# Altium schematic sheet 05_LMS7002M_Misc.SchDoc: LMS7002M misc (part 1 of 2)
size A3; Organization: Lime Microsystems; Address1: Surrey Tech Centre; Address2: Guildford GU2 7YG; Address3: Surrey; Address4: United Kingdom; SheetNumber: 5
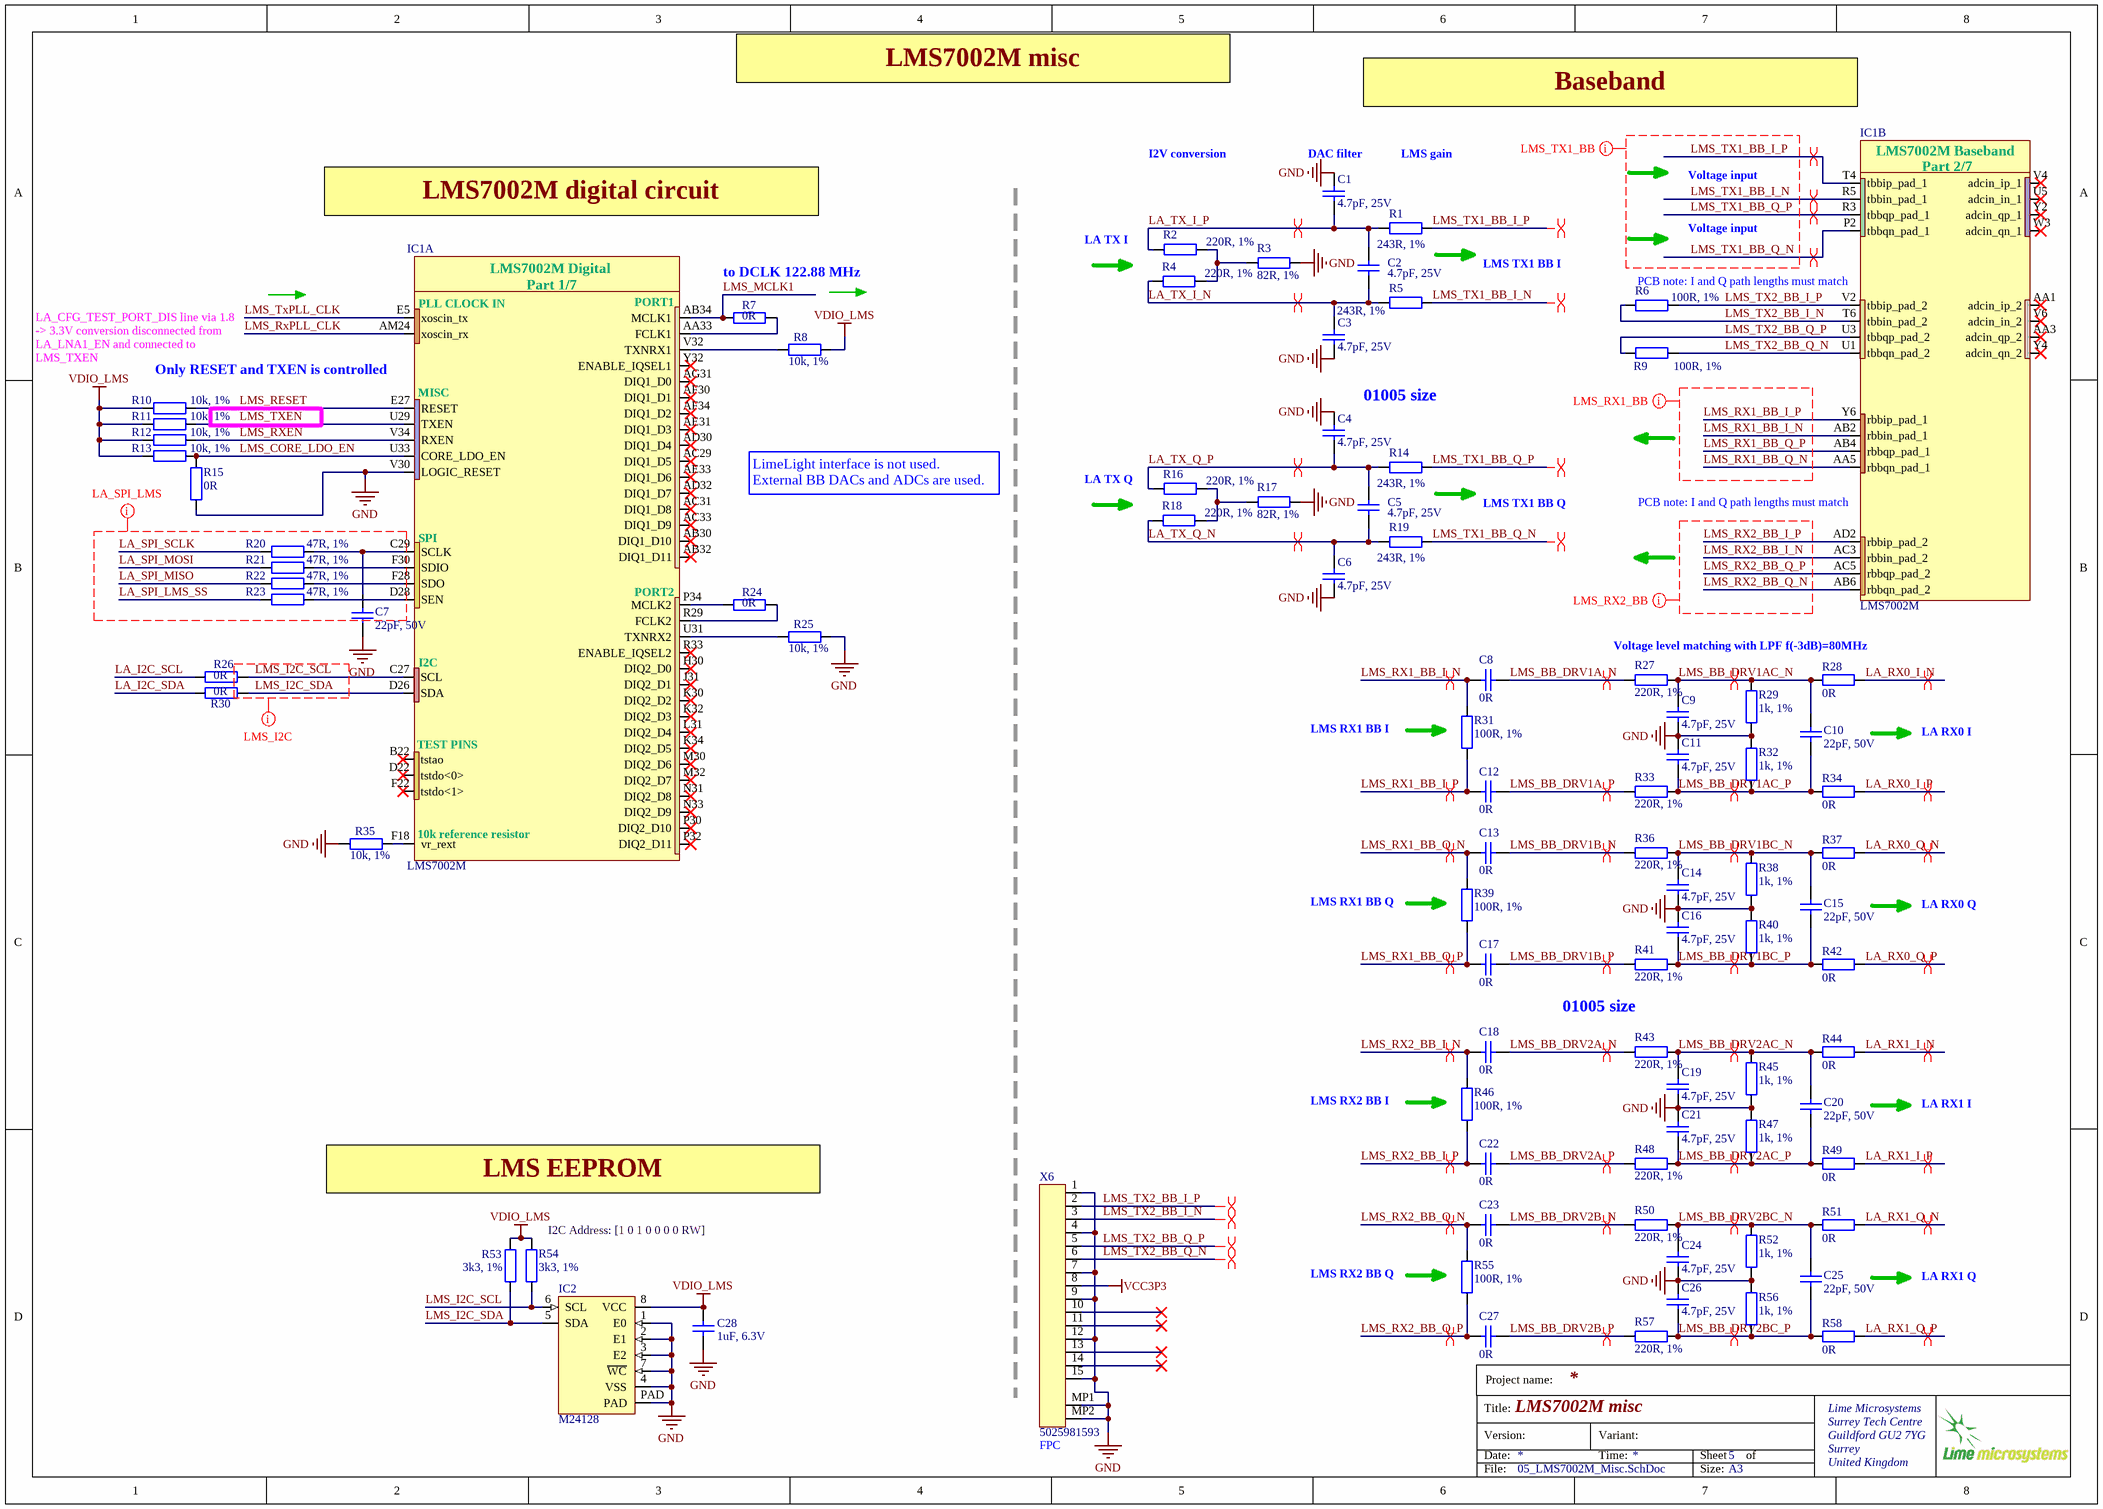
[diagram p0: 05_LMS7002M_Misc.SchDoc]

## Parts
C1  4.7pF, 25V  [CAP01005]
C2  4.7pF, 25V  [CAP01005]
C3  4.7pF, 25V  [CAP01005]
C4  4.7pF, 25V  [CAP01005]
C5  4.7pF, 25V  [CAP01005]
C6  4.7pF, 25V  [CAP01005]
C7  22pF, 50V  [CAP0201]
C8  0R  [CAP01005]
C9  4.7pF, 25V  [CAP01005]
C10  22pF, 50V  [CAP01005]
C11  4.7pF, 25V  [CAP01005]
C12  0R  [CAP01005]
C13  0R  [CAP01005]
C14  4.7pF, 25V  [CAP01005]
C15  22pF, 50V  [CAP01005]
C16  4.7pF, 25V  [CAP01005]
C17  0R  [CAP01005]
C18  0R  [CAP01005]
C19  4.7pF, 25V  [CAP01005]
C20  22pF, 50V  [CAP01005]
C21  4.7pF, 25V  [CAP01005]
C22  0R  [CAP01005]
C23  0R  [CAP01005]
C24  4.7pF, 25V  [CAP01005]
C25  22pF, 50V  [CAP01005]
C26  4.7pF, 25V  [CAP01005]
C27  0R  [CAP01005]
C28  1uF, 6.3V  [CAP0201]
IC1  LMS7002M  [LMS7002M_v5_LESS_SILK]  (parts A,B of 7)
IC2  M24128  [M24128-DFMC6TG]
R1  243R, 1%  [RES01005]
R2  220R, 1%  [RES01005]
R3  82R, 1%  [RES01005]
R4  220R, 1%  [RES01005]
R5  243R, 1%  [RES01005]
R6  100R, 1%  [RES0201]
R7  0R  [RES0201]
R8  10k, 1%  [RES0201]
R9  100R, 1%  [RES0201]
R10  10k, 1%  [RES0201]
R11  10k, 1%  [RES0201]
R12  10k, 1%  [RES0201]
R13  10k, 1%  [RES0201]
R14  243R, 1%  [RES01005]
R15  0R  [RES0402]
R16  220R, 1%  [RES01005]
R17  82R, 1%  [RES01005]
R18  220R, 1%  [RES01005]
R19  243R, 1%  [RES01005]
R20  47R, 1%  [RES0201]
R21  47R, 1%  [RES0201]
R22  47R, 1%  [RES0201]
R23  47R, 1%  [RES0201]
R24  0R  [RES0201]
R25  10k, 1%  [RES0201]
R26  0R  [RES0201]
R27  220R, 1%  [RES01005]
R28  0R  [RES01005]
R29  1k, 1%  [RES01005]
R30  0R  [RES0201]
R31  100R, 1%  [RES01005]
R32  1k, 1%  [RES01005]
R33  220R, 1%  [RES01005]
R34  0R  [RES01005]
R35  10k, 1%  [RES0201]
R36  220R, 1%  [RES01005]
R37  0R  [RES01005]
R38  1k, 1%  [RES01005]
R39  100R, 1%  [RES01005]
R40  1k, 1%  [RES01005]
R41  220R, 1%  [RES01005]
R42  0R  [RES01005]
R43  220R, 1%  [RES01005]
R44  0R  [RES01005]
R45  1k, 1%  [RES01005]
R46  100R, 1%  [RES01005]
R47  1k, 1%  [RES01005]
R48  220R, 1%  [RES01005]
R49  0R  [RES01005]
R50  220R, 1%  [RES01005]
R51  0R  [RES01005]
R52  1k, 1%  [RES01005]
R53  3k3, 1%  [RES0201]
R54  3k3, 1%  [RES0201]
R55  100R, 1%  [RES01005]
R56  1k, 1%  [RES01005]
R57  220R, 1%  [RES01005]
R58  0R  [RES01005]
X6  5025981593  [5025981593_FPC_connector]

## Nets
GND: C1.1 C3.2 C4.1 C6.2 C7.1 C9.2 C11.1 C14.2 C16.1 C19.2 C21.1 C24.2 C26.1 C28.2 IC1.V30(LOGIC_RESET) IC2.1(E0) IC2.2(E1) IC2.3(E2) IC2.4(VSS) IC2.7(~{WC}) IC2.PAD R3.1 R15.1 R17.1 R25.1 R29.2 R32.1 R35.2 R38.2 R40.1 R45.2 R47.1 R52.2 R56.1 X6.1 X6.4 X6.7 X6.9 X6.12 X6.15 X6.MP1 X6.MP2
VCC3P3: X6.8
VDIO_LMS: C28.1 IC2.8(VCC) R8.1 R10.2 R11.2 R12.2 R13.2 R53.2 R54.2
LA_I2C_SCL: R26.1
LA_I2C_SDA: R30.1
LA_RX0_I_N: R28.1
LA_RX0_I_P: R34.1
LA_RX0_Q_N: R37.1
LA_RX0_Q_P: R42.1
LA_RX1_I_N: R44.1
LA_RX1_I_P: R49.1
LA_RX1_Q_N: R51.1
LA_RX1_Q_P: R58.1
LA_SPI_LMS_SS: R23.2
LA_SPI_MISO: R22.2
LA_SPI_MOSI: R21.2
LA_SPI_SCLK: R20.2
LA_TX_I_N: C2.1 C3.1 R4.1 R5.2
LA_TX_I_P: C1.2 C2.2 R1.2 R2.1
LA_TX_Q_N: C5.1 C6.1 R18.1 R19.2
LA_TX_Q_P: C4.2 C5.2 R14.2 R16.1
LMS_BB_DRV1A_N: C8.1 R27.2
LMS_BB_DRV1A_P: C12.1 R33.2
LMS_BB_DRV1AC_N: C9.1 C10.1 R27.1 R28.2 R29.1
LMS_BB_DRV1AC_P: C10.2 C11.2 R32.2 R33.1 R34.2
LMS_BB_DRV1B_N: C13.1 R36.2
LMS_BB_DRV1B_P: C17.1 R41.2
LMS_BB_DRV1BC_N: C14.1 C15.1 R36.1 R37.2 R38.1
LMS_BB_DRV1BC_P: C15.2 C16.2 R40.2 R41.1 R42.2
LMS_BB_DRV2A_N: C18.1 R43.2
LMS_BB_DRV2A_P: C22.1 R48.2
LMS_BB_DRV2AC_N: C19.1 C20.1 R43.1 R44.2 R45.1
LMS_BB_DRV2AC_P: C20.2 C21.2 R47.2 R48.1 R49.2
LMS_BB_DRV2B_N: C23.1 R50.2
LMS_BB_DRV2B_P: C27.1 R57.2
LMS_BB_DRV2BC_N: C24.1 C25.1 R50.1 R51.2 R52.1
LMS_BB_DRV2BC_P: C25.2 C26.2 R56.2 R57.1 R58.2
LMS_CORE_LDO_EN: IC1.U33(CORE_LDO_EN) R13.1 R15.2
LMS_I2C_SCL: IC1.C27(SCL) IC2.6(SCL) R26.2 R54.1
LMS_I2C_SDA: IC1.D26(SDA) IC2.5(SDA) R30.2 R53.1
LMS_MCLK1: IC1.AB34(MCLK1) R7.1
LMS_RESET: IC1.E27(RESET) R10.1
LMS_RX1_BB_I_N: C8.2 IC1.AB2(rbbin_pad_1) R31.1
LMS_RX1_BB_I_P: C12.2 IC1.Y6(rbbip_pad_1) R31.2
LMS_RX1_BB_Q_N: C13.2 IC1.AA5(rbbqn_pad_1) R39.1
LMS_RX1_BB_Q_P: C17.2 IC1.AB4(rbbqp_pad_1) R39.2
LMS_RX2_BB_I_N: C18.2 IC1.AC3(rbbin_pad_2) R46.1
LMS_RX2_BB_I_P: C22.2 IC1.AD2(rbbip_pad_2) R46.2
LMS_RX2_BB_Q_N: C23.2 IC1.AB6(rbbqn_pad_2) R55.1
LMS_RX2_BB_Q_P: C27.2 IC1.AC5(rbbqp_pad_2) R55.2
LMS_RXEN: IC1.V34(RXEN) R12.1
LMS_RxPLL_CLK: IC1.AM24(xoscin_rx)
LMS_TX1_BB_I_N: IC1.R5(tbbin_pad_1) R5.1
LMS_TX1_BB_I_P: IC1.T4(tbbip_pad_1) R1.1
LMS_TX1_BB_Q_N: IC1.P2(tbbqn_pad_1) R19.1
LMS_TX1_BB_Q_P: IC1.R3(tbbqp_pad_1) R14.1
LMS_TX2_BB_I_N: IC1.T6(tbbin_pad_2) R6.1 X6.3
LMS_TX2_BB_I_P: IC1.V2(tbbip_pad_2) R6.2 X6.2
LMS_TX2_BB_Q_N: IC1.U1(tbbqn_pad_2) R9.2 X6.6
LMS_TX2_BB_Q_P: IC1.U3(tbbqp_pad_2) R9.1 X6.5
LMS_TXEN: IC1.U29(TXEN) R11.1
LMS_TxPLL_CLK: IC1.E5(xoscin_tx)
NetC7_2: C7.2 IC1.C29(SCLK) R20.1
NetIC1_AA33: IC1.AA33(FCLK1) R7.2
NetIC1_D28: IC1.D28(SEN) R23.1
NetIC1_F18: IC1.F18(vr_rext) R35.1
NetIC1_F28: IC1.F28(SDO) R22.1
NetIC1_F30: IC1.F30(SDIO) R21.1
NetIC1_P34: IC1.P34(MCLK2) R24.1
NetIC1_R29: IC1.R29(FCLK2) R24.2
NetIC1_U31: IC1.U31(TXNRX2) R25.2
NetIC1_V32: IC1.V32(TXNRX1) R8.2
NetR2_2: R2.2 R3.2 R4.2
NetR16_2: R16.2 R17.2 R18.2

Not connected (* = marked no-connect by the designer): IC1 AA1(adcin_ip_2)* AA3(adcin_qp_2)* AB30(DIQ1_D10)* AB32(DIQ1_D11)* AC29(DIQ1_D5)* AC31(DIQ1_D8)* AC33(DIQ1_D9)* AD30(DIQ1_D4)* AD32(DIQ1_D7)* AE31(DIQ1_D3)* AE33(DIQ1_D6)* AF30(DIQ1_D1)* AF34(DIQ1_D2)* AG31(DIQ1_D0)* B22(tstao)* D22(tstdo<0>)* F22(tstdo<1>)* H30(DIQ2_D0)* J31(DIQ2_D1)* K30(DIQ2_D2)* K32(DIQ2_D3)* K34(DIQ2_D5)* L31(DIQ2_D4)* M30(DIQ2_D6)* M32(DIQ2_D7)* N31(DIQ2_D8)* N33(DIQ2_D9)* P30(DIQ2_D10)* P32(DIQ2_D11)* R33(ENABLE_IQSEL2)* U5(adcin_in_1)* V4(adcin_ip_1)* V6(adcin_in_2)* W3(adcin_qn_1)* Y2(adcin_qp_1)* Y4(adcin_qn_2)* Y32(ENABLE_IQSEL1)*; X6 10* 11* 13* 14*

## Layout directives
net class LMS_I2C: LMS_I2C_SCL, LMS_I2C_SDA
differential pair: LA_RX0_I_N, LA_RX0_I_P, LA_RX0_Q_N, LA_RX0_Q_P, LA_RX1_I_N, LA_RX1_I_P, LA_RX1_Q_N, LA_RX1_Q_P, LA_TX_I_N, LA_TX_I_P, LA_TX_Q_N, LA_TX_Q_P, LMS_BB_DRV1A_N, LMS_BB_DRV1A_P, LMS_BB_DRV1AC_N, LMS_BB_DRV1AC_P, LMS_BB_DRV1B_N, LMS_BB_DRV1B_P, LMS_BB_DRV1BC_N, LMS_BB_DRV1BC_P, LMS_BB_DRV2A_N, LMS_BB_DRV2A_P, LMS_BB_DRV2AC_N, LMS_BB_DRV2AC_P, LMS_BB_DRV2B_N, LMS_BB_DRV2B_P, LMS_BB_DRV2BC_N, LMS_BB_DRV2BC_P, LMS_RX1_BB_I_N, LMS_RX1_BB_I_P, LMS_RX1_BB_Q_N, LMS_RX1_BB_Q_P, LMS_RX2_BB_I_N, LMS_RX2_BB_I_P, LMS_RX2_BB_Q_N, LMS_RX2_BB_Q_P, LMS_TX1_BB_I_N, LMS_TX1_BB_I_P, LMS_TX1_BB_Q_N, LMS_TX1_BB_Q_P, LMS_TX2_BB_I_N, LMS_TX2_BB_I_P, LMS_TX2_BB_Q_N, LMS_TX2_BB_Q_P
net class LA_SPI_LMS: LA_SPI_LMS_SS, LA_SPI_MISO, LA_SPI_MOSI, LA_SPI_SCLK
net class LMS_RX1_BB: LMS_RX1_BB_I_N, LMS_RX1_BB_I_P, LMS_RX1_BB_Q_N, LMS_RX1_BB_Q_P
net class LMS_RX2_BB: LMS_RX2_BB_I_N, LMS_RX2_BB_I_P, LMS_RX2_BB_Q_N, LMS_RX2_BB_Q_P
net class LMS_TX1_BB: LMS_TX1_BB_I_N, LMS_TX1_BB_I_P, LMS_TX1_BB_Q_N, LMS_TX1_BB_Q_P

## Notes on the sheet
- LMS7002M misc
- Baseband
- I2V conversion
- (near C1) DAC filter
- LMS gain
- Voltage input
- LMS7002M digital circuit
- LA TX I
- to DCLK 122.88 MHz
- LMS TX1 BB I
- (near IC1) PCB note: I and Q path lengths must match
- LA_CFG_TEST_PORT_DIS line via 1.8 -> 3.3V conversion disconnected from LA_LNA1_EN and connected to LMS_TXEN
- (near IC1) Only RESET and TXEN is controlled
- 01005 size
- LimeLight interface is not used.
  External BB DACs and ADCs are used.
- LA TX Q
- LMS TX1 BB Q
- Voltage level matching with LPF f(-3dB)=80MHz
- LMS RX1 BB I
- LA RX0 I
- LMS RX1 BB Q
- LA RX0 Q
- LMS RX2 BB I
- LA RX1 I
- LMS EEPROM
- (near R54) I2C Address: [1 0 1 0 0 0 0 RW]
- LMS RX2 BB Q
- LA RX1 Q
- (near X6) FPC
- Project name:
- Title:
- Version:
- Date:
- Variant:
- Time:
- Sheet
- of
- File:
- Size:
- A3
- (in symbol LMS7002Mr4, part A) LMS7002M Digital; Part 1/7; PORT1; PLL CLOCK IN; MISC; SPI; PORT2; I2C; TEST PINS; 10k reference resistor
- (in symbol LMS7002Mr4, part B) LMS7002M Baseband; Part 2/7